# EasyEDA Pro project LeakSensor.eprj

# Schematic Schematic1
Board Name: Board1; Create Date: 2024-12-01; Page Name: P1; Project Name: LeakSensor; Schematic Name: Schematic1; Update Date: 2024-12-01; Company: 嘉立创EDA; Page Size: A4; Version: V1.0
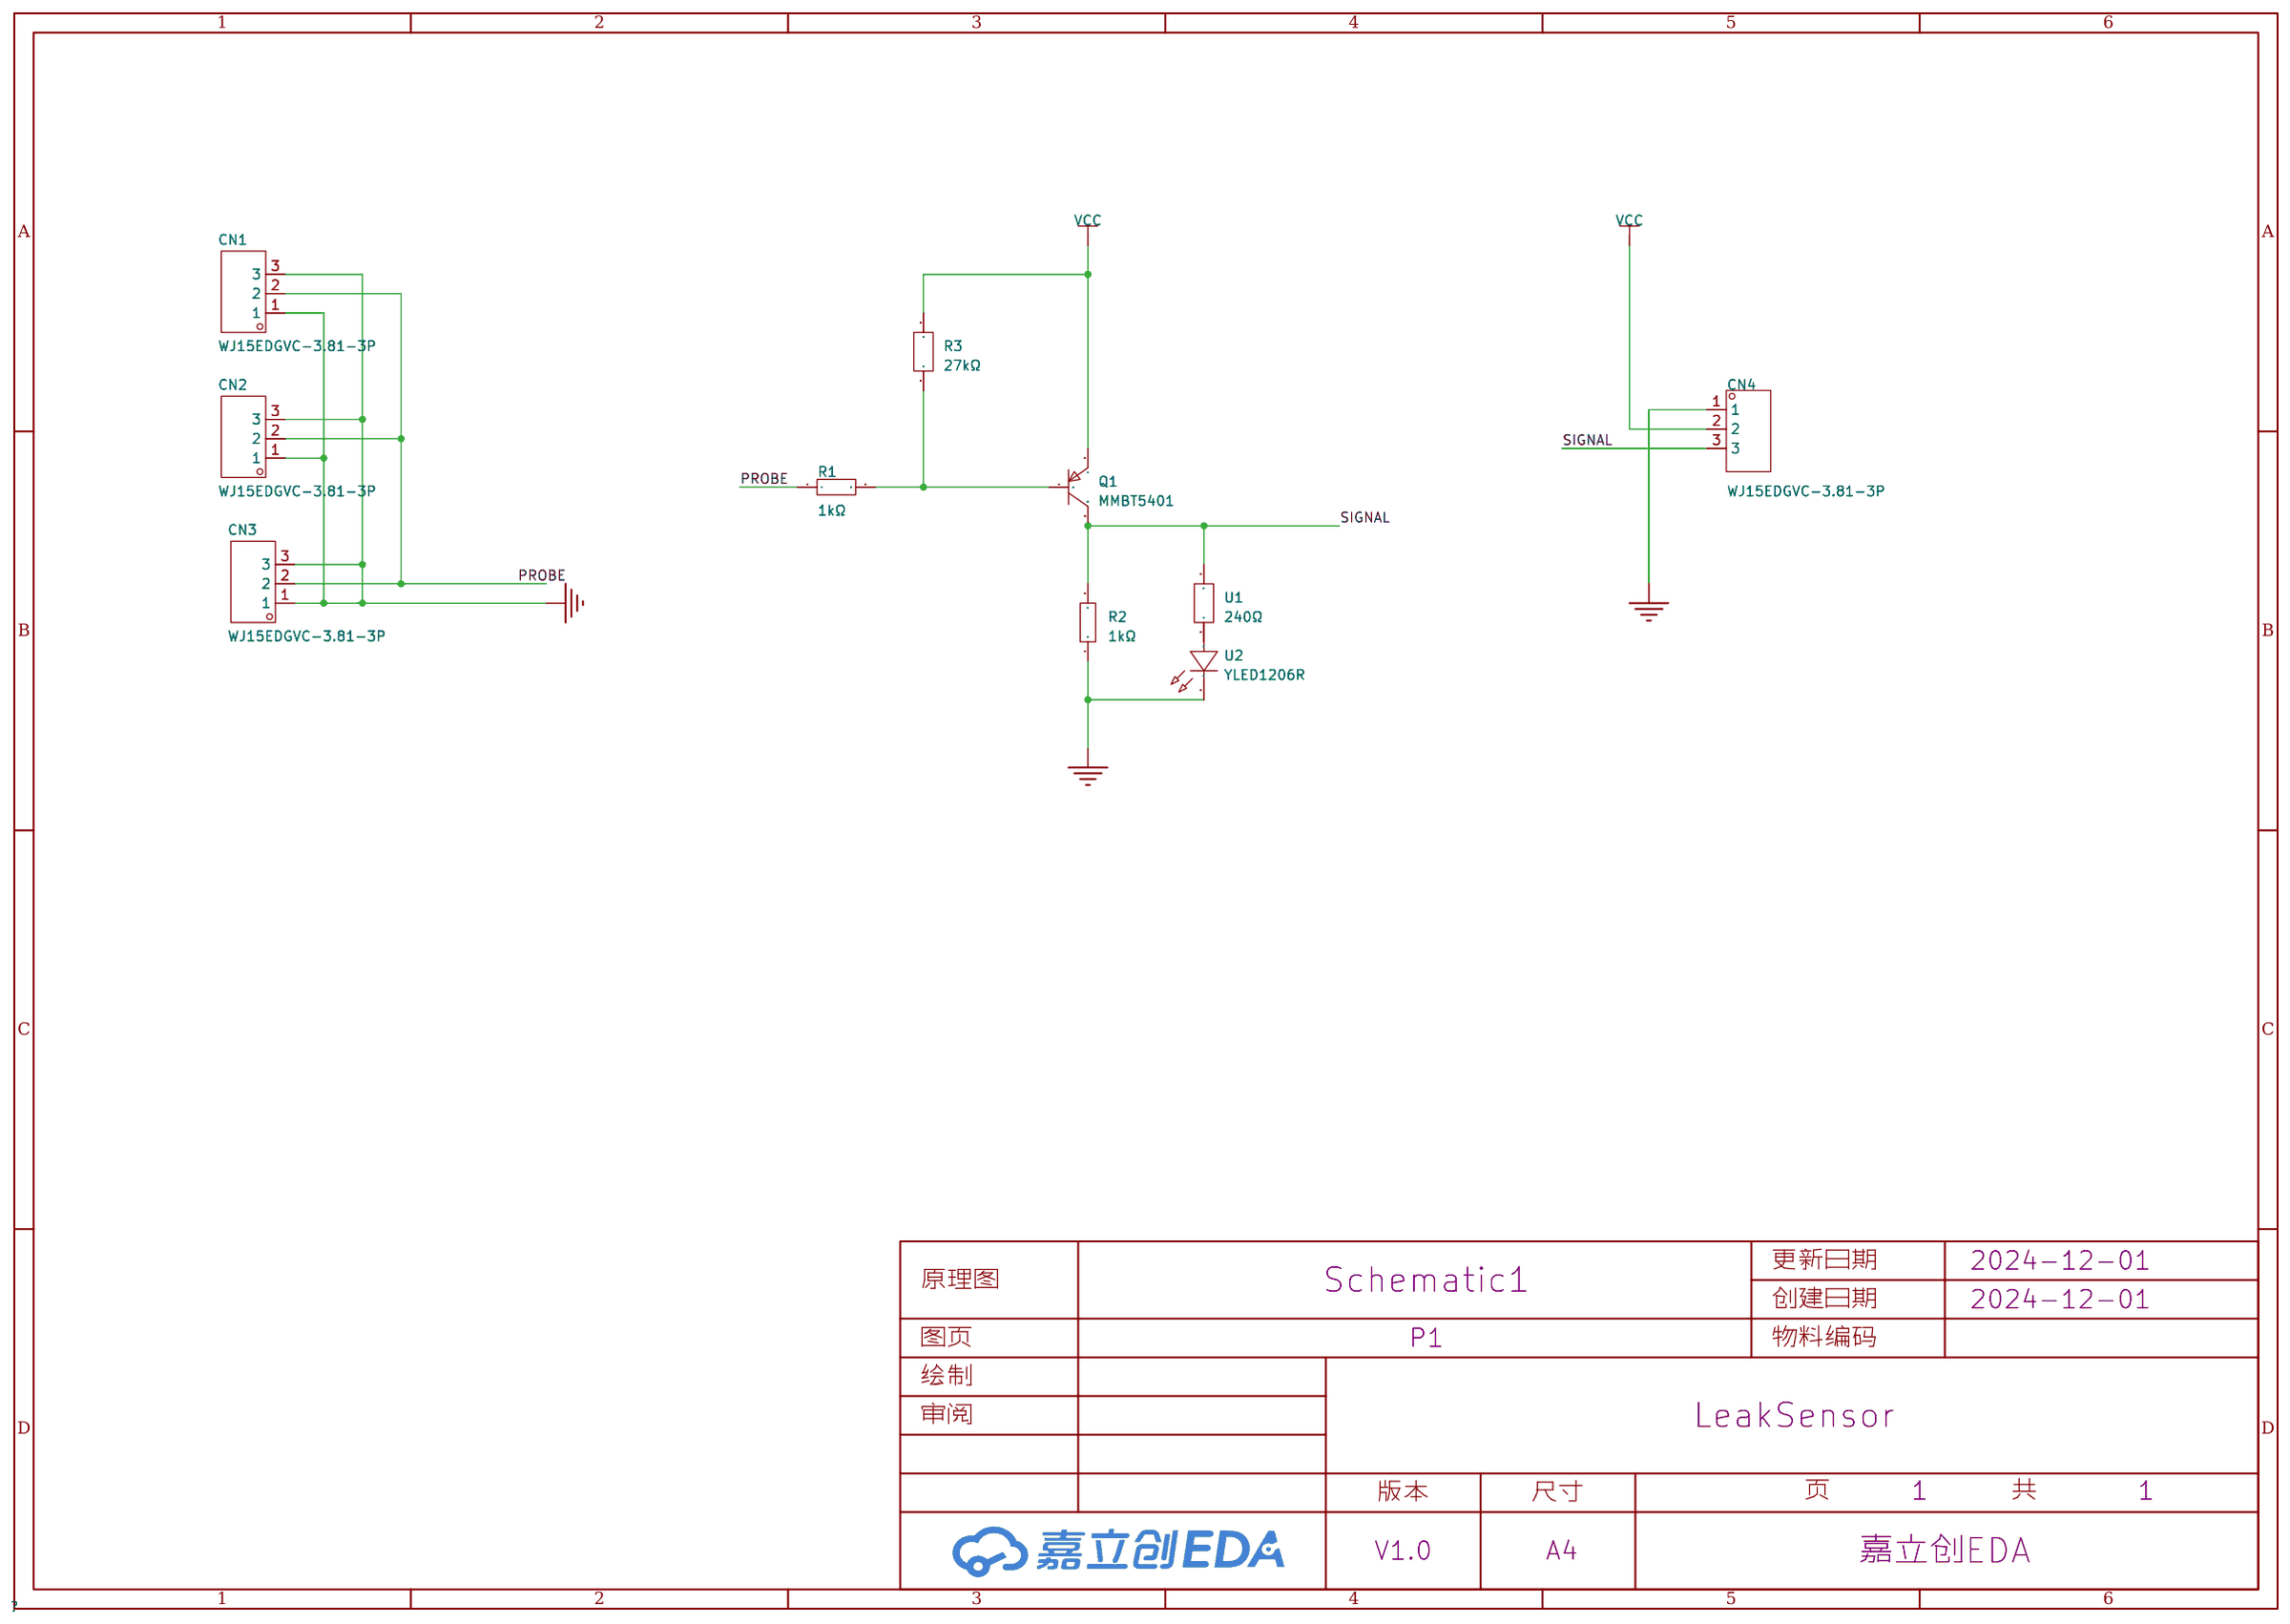
[diagram p0: schematic sheet]

## Parts
CN1  WJ15EDGVC-3.81-3P  [CONN-TH_3P-P3.81_WJ15EDGVC-3.81-3P]
CN2  WJ15EDGVC-3.81-3P  [CONN-TH_3P-P3.81_WJ15EDGVC-3.81-3P]
CN3  WJ15EDGVC-3.81-3P  [CONN-TH_3P-P3.81_WJ15EDGVC-3.81-3P]
CN4  WJ15EDGVC-3.81-3P  [CONN-TH_3P-P3.81_WJ15EDGVC-3.81-3P]
Q1  MMBT5401  [SOT-23-3_L2.9-W1.3-P1.90-LS2.4-BR]
R1  1kΩ  [R1206]
R2  1kΩ  [R1206]
R3  27kΩ  [R2010]
U1  240Ω  [R1206]
U2  YLED1206R  [LED1206-FD]

## Library data of the parts
CN1-CN4 = WJ15EDGVC-3.81-3P: LCSC Part Name: 1x3P 3.81mm 排数:1 每排P数:3; Supplier Part: C8389; Manufacturer: KANGNEX(康奈克斯电气); Supplier Footprint: 插件,P=3.81mm; JLCPCB Part Class: 扩展库; Datasheet: https://atta.szlcsc.com/upload/public/pdf/source/20191225/C8389_B21BE5A0E910B8F69CE6926ACBB2B491.pdf; Supplier: LCSC; Connector Type: 板端/插座-闭口; Structure: 1x3P; Pitch: 3.81mm; Mounting Style: 直针; Number of Pins: 3P; Number of Rows: 1; Number of PINs Per Row: 3; Current Rating (Max): 8A; Voltage Rating (Max): 300V; Contact Material: 黄铜; Contact Plating: 锡; Operating Temperature Range: -40℃~+105℃
Q1 = MMBT5401_C7420356: LCSC Part Name: 耐压:160V 电流:600mA PNP; Supplier Part: C7420356; Manufacturer: 宏迦橙; Supplier Footprint: SOT-23; JLCPCB Part Class: 扩展库; Datasheet: https://atta.szlcsc.com/upload/public/pdf/source/20231222/6F2EFB88864CB3667B599FCF39694FDC.pdf; Supplier: LCSC; Transistor Type: PNP; Collector Current (Ic): 600mA; Collector-Emitter Breakdown Voltage (Vceo): 160V; Power Dissipation (Pd): 300mW; DC Current Gain (hFE@Ic,Vce): 100@10mA,5.0V; Transition Frequency (fT): 100MHz; Collector Cut-Off Current (Icbo): 100nA; Collector-Emitter Saturation Voltage (VCE(sat)@Ic,Ib): 200mV@10mA,1.0mA; Operating Temperature: -55℃~+150℃
R1 R2 = 1206W4F1001T5E_C4410: LCSC Part Name: 1kΩ ±1% 250mW 厚膜电阻; Supplier Part: C4410; Manufacturer: UNI-ROYAL(厚声); Manufacturer Part: 1206W4F1001T5E; Supplier Footprint: 1206; JLCPCB Part Class: 基础库; Datasheet: https://atta.szlcsc.com/upload/public/pdf/source/20200306/C422600_1E6D84923E4A46A82E41ADD87F860B5C.pdf; Supplier: LCSC; Type: 厚膜电阻; Tolerance: ±1%; Power(Watts): 250mW; Overload Voltage (Max): 200V; Operating Temperature Range: -55℃~+155℃
R3 = FRC2010F2702TS: LCSC Part Name: 27kΩ ±1% 750mW 厚膜电阻; Supplier Part: C3000762; Manufacturer: FOJAN(富捷); Supplier Footprint: 2010; JLCPCB Part Class: 扩展库; Datasheet: https://atta.szlcsc.com/upload/public/pdf/source/20211221/925EC7D7225764EE0046F22065062C87.pdf; Supplier: LCSC; Type: 厚膜电阻; Tolerance: ±1%; Power(Watts): 750mW; Overload Voltage (Max): 200V; Temperature Coefficient: ±100ppm/℃
U1 = FRC1206F2400TS: LCSC Part Name: 240Ω ±1% 250mW 厚膜电阻; Supplier Part: C2933649; Manufacturer: FOJAN(富捷); Supplier Footprint: 1206; JLCPCB Part Class: 扩展库; Datasheet: https://atta.szlcsc.com/upload/public/pdf/source/20211221/925EC7D7225764EE0046F22065062C87.pdf; Supplier: LCSC; Type: 厚膜电阻; Tolerance: ±1%; Power(Watts): 250mW; Overload Voltage (Max): 200V; Temperature Coefficient: ±100ppm/℃; Operating Temperature Range: -55℃~+155℃
U2 = YLED1206R: LCSC Part Name: 发光管; Supplier Part: C28310439; Manufacturer: YONGYUTAI(永裕泰); Supplier Footprint: 1206; JLCPCB Part Class: 扩展库; Datasheet: https://atta.szlcsc.com/upload/public/pdf/source/20240711/17C120EFA4A39059E81636F4CEFAEB8D.pdf; Supplier: LCSC

## Nets
GND: CN1.1 CN1.3 CN2.1 CN2.3 CN3.1 CN3.3 CN4.1 R2.1 U2.2
VCC: CN4.2 Q1.2(E) R3.2
PROBE: CN1.2 CN2.2 CN3.2 R1.1
SIGNAL: CN4.3 Q1.3(C) R2.2 U1.2
$1N997: Q1.1(B) R1.2 R3.1
$1N1276: U1.1 U2.1

# Board PCB1
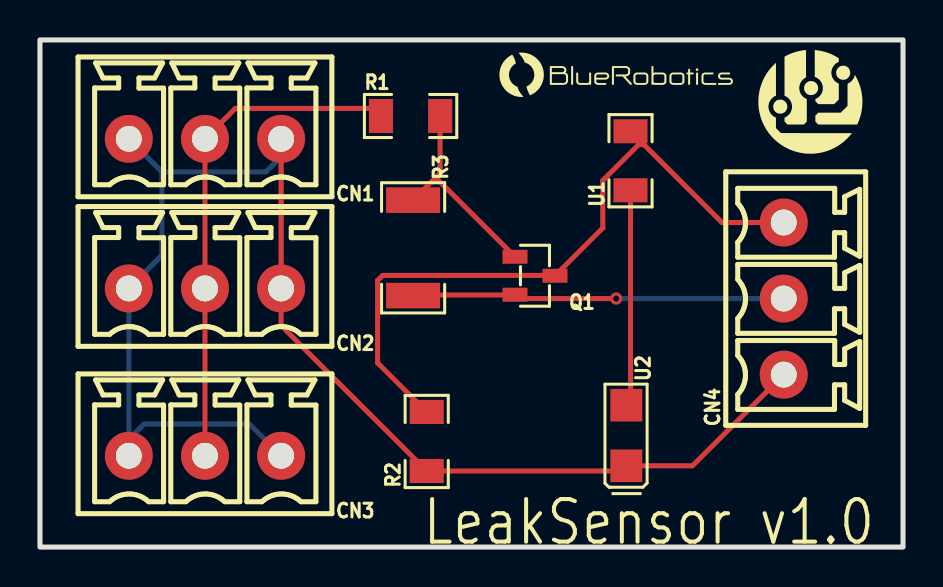
[diagram p1: board, top side]
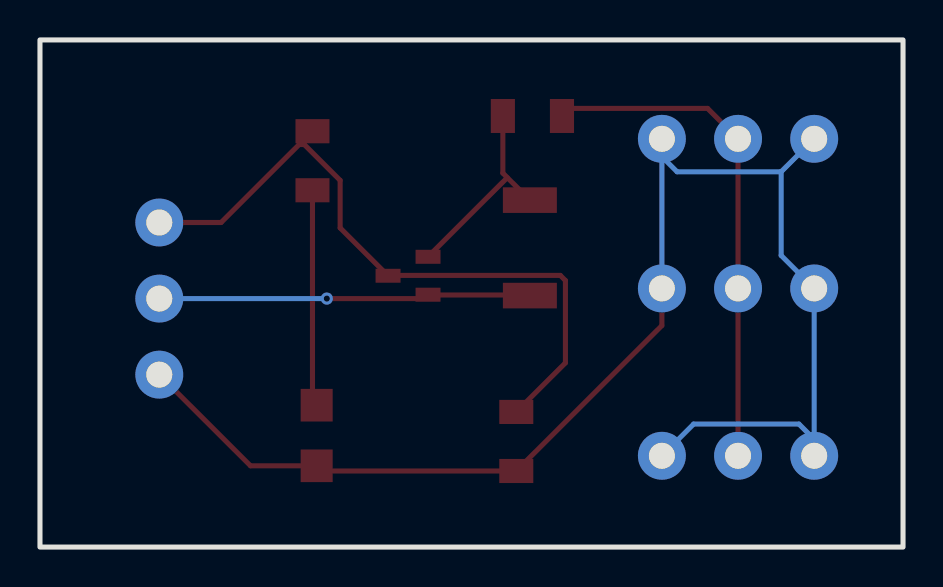
[diagram p2: board, bottom side, seen from below]

Outline 43.18 x 25.4 mm; copper layers: Top Layer, Bottom Layer. Coordinates in mm from the lower left corner of the outline.
Outline path: rectangle 0,25.4 43.18,0
Stack: Top Layer 0.035mm / Dielectric1 1.51mm FR4 er 4.5 / Bottom Layer 0.035mm

## Design rules (mm)
template: JLCPCB Capability(Two Layers Board)
spacing copperThickness1oz (default): track to track 0.102, other pairs 0.152 to 0.3
spacing copperThickness2oz: track to track 0.203, other pairs 0.152 to 0.3
track width copperThickness1oz (default): min 0.127, default 0.254, max 2.54
track width copperThickness2oz: min 0.203, default 0.254, max 2.54
differential pair differentialPair (default): width min 0.127, default 0.254, max 2.54; gap min 0.152, default 0.152
via viaSize (default): diameter min 0.5, default 0.61, max 10; hole min 0.3, default 0.305, max 6.3

## Placement (name value [footprint] x y rotation side)
CN1  WJ15EDGVC-3.81-3P  [CONN-TH_3P-P3.81_WJ15EDGVC-3.81-3P]  8.26 20.45 180 top
CN2  WJ15EDGVC-3.81-3P  [CONN-TH_3P-P3.81_WJ15EDGVC-3.81-3P]  8.26 12.95 180 top
CN3  WJ15EDGVC-3.81-3P  [CONN-TH_3P-P3.81_WJ15EDGVC-3.81-3P]  8.26 4.57 180 top
CN4  WJ15EDGVC-3.81-3P  [CONN-TH_3P-P3.81_WJ15EDGVC-3.81-3P]  37.21 12.45 90 top
Q1  MMBT5401  [SOT-23-3_L2.9-W1.3-P1.90-LS2.4-BR]  24.77 13.59 180 top
R1  1kΩ  [R1206]  18.54 21.59 0 top
R2  1kΩ  [R1206]  19.35 5.29 90 top
R3  27kΩ  [R2010]  18.67 14.99 270 top
U1  240Ω  [R1206]  29.55 19.35 90 top
U2  YLED1206R  [LED1206-FD]  29.34 5.59 270 top

## Footprints (pads in the part's own frame, mm; a bottom-side part is the same pattern mirrored in y, then rotated)
CONN-TH_3P-P3.81_WJ15EDGVC-3.81-3P
  round 2.4 hole 1.3: 1(-3.81,0) 2(0,0) 3(3.81,0)
LED1206-FD
  rect 1.635x1.6 smd: 1(-1.518,0) 2(1.518,0)
R1206
  rect 1.208x1.701 smd: 1(-1.479,0) 2(1.479,0)
R2010
  rect 1.282x2.7 smd: 1(-2.391,0) 2(2.391,0)
SOT-23-3_L2.9-W1.3-P1.90-LS2.4-BR
  rect 1.25x0.7 smd: 1(1,-0.95) 2(1,0.95) 3(-1,0)

## Nets
As in the schematic.

## Via types
v1: diameter 0.61, hole 0.305, Top Layer to Bottom Layer, 1 via

## Routing (per net, layer and track width the routed paths; a pad name or vN(x,y) marks a point on that pad's centre or on a via; arc(x,y) is an arc through that point)
GND: length 79.1
  Top Layer w0.254: CN1.1 CN2.1 12.07,11.09 R2.1 29.08,3.81 U2.2 32.65,4.07 CN4.1
  Bottom Layer w0.254: 6.1,18.8 CN1.3 ; 6.1,18.8 11.3,18.8 12.07,19.56 ; 6.1,18.8 6.1,14.6 CN2.3 4.45,5.4 ; 12.07,19.56 CN2.1 ; 12.07,19.56 CN1.1 ; 4.45,5.4 CN3.3 ; 4.45,5.4 5.21,6.16 10.48,6.16 CN3.1
VCC: length 18.6
  Top Layer w0.254: v1(28.83,12.45) 23.96,12.45 23.78,12.63 ; 23.78,12.63 18.7,12.63 R3.2 ; 23.78,12.63 Q1.2
  Bottom Layer w0.254: CN4.2 v1(28.83,12.45)
PROBE: length 25.5
  Top Layer w0.254: CN3.2 CN2.2 CN1.2 9.78,21.97 16.68,21.97 R1.1
SIGNAL: length 34.7
  Top Layer w0.254: 25.78,13.61 28.16,15.99 28.16,18.37 29.96,20.16 30.21,20.16 ; 25.78,13.61 Q1.3 ; 25.78,13.61 17.15,13.61 16.89,13.35 16.89,9.22 R2.2 ; 30.21,20.16 U1.2 ; 30.21,20.16 34.12,16.26 CN4.3
$1N997: length 10.4
  Top Layer w0.254: 19.8,18.5 23.77,14.54 ; R3.1 20.02,18.73 R1.2
$1N1276: length 10.9
  Top Layer w0.254: U1.1 29.55,7.31 U2.1

## Text on the board
Top Silkscreen Layer: LeakSensor v1.0
